# Altium project BMU_v50.PrjPcb (part 5 of 5)
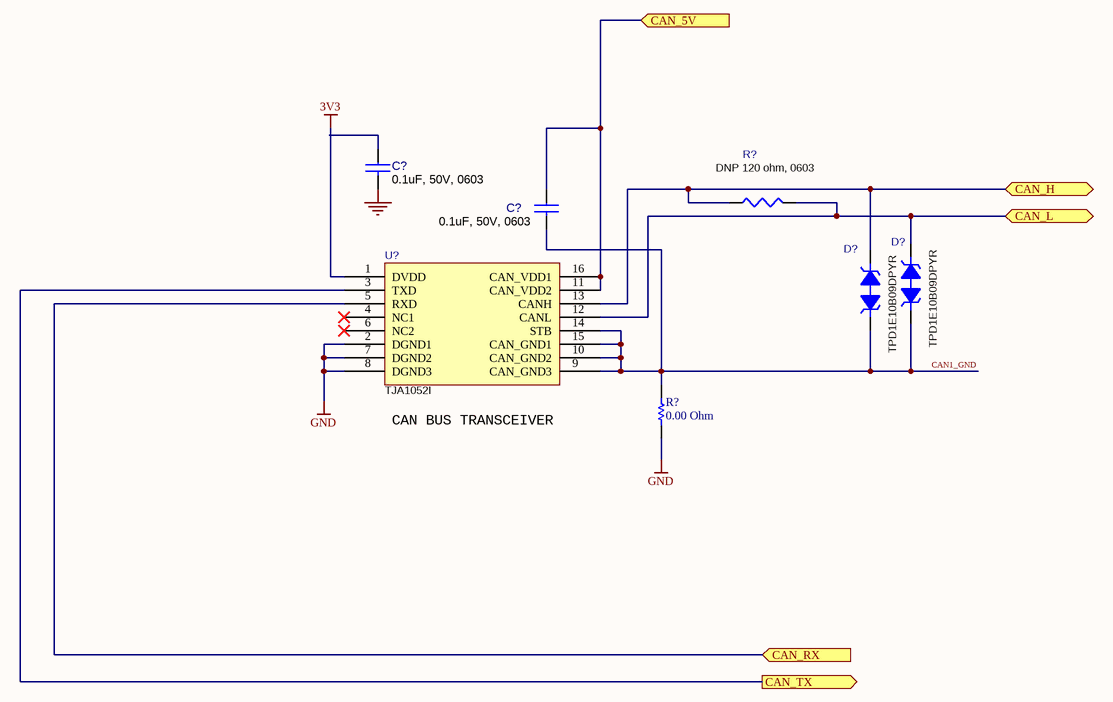
[diagram p12: BMU_V50_CAN.SchDoc]

## Nets that join several sheets
3V3: StringA/U_BMU_V50_StringFG (R?_StringA_U_BMU_V50_StringFG#2.2 R?_StringA_U_BMU_V50_StringFG#3.2 R?_StringA_U_BMU_V50_StringFG#4.2 R?_StringA_U_BMU_V50_StringFG#5.2), BMU_V50_MCUcomplex (21 pins), BMU_V50_MCUpower (L?#1.2 L?#4.2 TP?#3.1), BMU_V50_CAN (U?#3.1), StringB/U_BMU_V50_StringFG (R?_StringB_U_BMU_V50_StringFG#2.2 R?_StringB_U_BMU_V50_StringFG#3.2 R?_StringB_U_BMU_V50_StringFG#4.2 R?_StringB_U_BMU_V50_StringFG#5.2)
GND: BMU_V50_BlockDiagram (6 pins), BMU_V50_Connector (R?#1.1 R?#2.1 R?#3.2), StringA (6 pins), StringA/U_BMU_V50_StringFG (9 pins), StringA/U_BMU_V50_CellBalancer (D?_StringA_U_BMU_V50_CellBalancer.C J?_StringA_U_BMU_V50_CellBalancer#1.TAB1 J?_StringA_U_BMU_V50_CellBalancer#1.TAB2), StringA/U_BMU_V50_CellBalancer/U_BMU_V50_CellBalanceTaps (13 pins), StringA/U_BMU_V50_CellBalancer/U_BMU_V50_CellBalanceIC (15 pins), StringA/U_BMU_V50_CellBalancer/EXT_MEAS1 (C?_StringA_U_BMU_V50_CellBalancer_EXT_MEAS1.2), StringA/U_BMU_V50_CellBalancer/EXT_MEAS2 (C?_StringA_U_BMU_V50_CellBalancer_EXT_MEAS2.2), StringA/U_BMU_V50_CellBalancer/EXT_MEAS3 (C?_StringA_U_BMU_V50_CellBalancer_EXT_MEAS3.2), StringA/U_BMU_V50_CellBalancer/EXT_MEAS4 (C?_StringA_U_BMU_V50_CellBalancer_EXT_MEAS4.2), StringA/U_BMU_V50_StringPWRControl (C?_StringA_U_BMU_V50_StringPWRControl#5.1 C?_StringA_U_BMU_V50_StringPWRControl#7.1 R?_StringA_U_BMU_V50_StringPWRControl#13.1 U?_StringA_U_BMU_V50_StringPWRControl.9), BMU_V50_MCUcomplex (26 pins), BMU_V50_MCUpower (14 pins), BMU_V50_CAN (5 pins), StringB (6 pins), StringB/U_BMU_V50_StringFG (9 pins), StringB/U_BMU_V50_CellBalancer (D?_StringB_U_BMU_V50_CellBalancer.C J?_StringB_U_BMU_V50_CellBalancer#1.TAB1 J?_StringB_U_BMU_V50_CellBalancer#1.TAB2), StringB/U_BMU_V50_CellBalancer/U_BMU_V50_CellBalanceTaps (13 pins), StringB/U_BMU_V50_CellBalancer/U_BMU_V50_CellBalanceIC (15 pins), StringB/U_BMU_V50_CellBalancer/EXT_MEAS1 (C?_StringB_U_BMU_V50_CellBalancer_EXT_MEAS1.2), StringB/U_BMU_V50_CellBalancer/EXT_MEAS2 (C?_StringB_U_BMU_V50_CellBalancer_EXT_MEAS2.2), StringB/U_BMU_V50_CellBalancer/EXT_MEAS3 (C?_StringB_U_BMU_V50_CellBalancer_EXT_MEAS3.2), StringB/U_BMU_V50_CellBalancer/EXT_MEAS4 (C?_StringB_U_BMU_V50_CellBalancer_EXT_MEAS4.2), StringB/U_BMU_V50_StringPWRControl (C?_StringB_U_BMU_V50_StringPWRControl#5.1 C?_StringB_U_BMU_V50_StringPWRControl#7.1 R?_StringB_U_BMU_V50_StringPWRControl#13.1 U?_StringB_U_BMU_V50_StringPWRControl.9)
NEG: StringA/U_BMU_V50_StringPWRControl (C?_StringA_U_BMU_V50_StringPWRControl#6.2 D?_StringA_U_BMU_V50_StringPWRControl.1 R?_StringA_U_BMU_V50_StringPWRControl#11.1), StringB/U_BMU_V50_StringPWRControl (C?_StringB_U_BMU_V50_StringPWRControl#6.2 D?_StringB_U_BMU_V50_StringPWRControl.1 R?_StringB_U_BMU_V50_StringPWRControl#11.1)
CAN1_RX: BMU_V50_MCUcomplex (R?#8.1 U?#1.44), BMU_V50_CAN (U?#3.5)
CAN1_TX: BMU_V50_MCUcomplex (U?#1.45), BMU_V50_CAN (U?#3.3)
CAN_H: BMU_V50_Connector (J?#3.21), BMU_V50_CAN (D?#10.2 R?#21.1 U?#3.13)
CAN_L: BMU_V50_Connector (J?#3.22), BMU_V50_CAN (D?#9.2 R?#21.2 U?#3.12)
CHECK_INSERT_B: BMU_V50_Connector (J?#3.19), BMU_V50_MCUcomplex (U?#1.11)
I2C1_SCL: BMU_V50_BlockDiagram (J?#1.2), StringA/U_BMU_V50_StringFG (R?_StringA_U_BMU_V50_StringFG#5.1 U?_StringA_U_BMU_V50_StringFG.13), BMU_V50_MCUcomplex (R?#15.1 U?#1.58)
I2C1_SDA: BMU_V50_BlockDiagram (J?#1.3), StringA/U_BMU_V50_StringFG (R?_StringA_U_BMU_V50_StringFG#4.1 U?_StringA_U_BMU_V50_StringFG.14), BMU_V50_MCUcomplex (R?#16.1 U?#1.59)
I2C2_SCL: BMU_V50_BlockDiagram (J?#2.2), BMU_V50_MCUcomplex (R?#9.1 U?#1.42), StringB/U_BMU_V50_StringFG (R?_StringB_U_BMU_V50_StringFG#5.1 U?_StringB_U_BMU_V50_StringFG.13)
I2C2_SDA: BMU_V50_BlockDiagram (J?#2.3), BMU_V50_MCUcomplex (R?#10.1 U?#1.43), StringB/U_BMU_V50_StringFG (R?_StringB_U_BMU_V50_StringFG#4.1 U?_StringB_U_BMU_V50_StringFG.14)
NetC?#18_1: BMU_V50_Connector (J?#3.17), BMU_V50_CAN (C?#18.1 U?#3.11 U?#3.16)
NetC?_StringA_U_BMU_V50_CellBalancer_EXT_MEAS1_1: StringA (J?_StringA#2.1), StringA/U_BMU_V50_CellBalancer/EXT_MEAS1 (C?_StringA_U_BMU_V50_CellBalancer_EXT_MEAS1.1 R?_StringA_U_BMU_V50_CellBalancer_EXT_MEAS1#1.1 R?_StringA_U_BMU_V50_CellBalancer_EXT_MEAS1#2.1)
NetC?_StringA_U_BMU_V50_CellBalancer_EXT_MEAS2_1: StringA (J?_StringA#2.3), StringA/U_BMU_V50_CellBalancer/EXT_MEAS2 (C?_StringA_U_BMU_V50_CellBalancer_EXT_MEAS2.1 R?_StringA_U_BMU_V50_CellBalancer_EXT_MEAS2#1.1 R?_StringA_U_BMU_V50_CellBalancer_EXT_MEAS2#2.1)
NetC?_StringA_U_BMU_V50_CellBalancer_EXT_MEAS3_1: StringA (J?_StringA#2.5), StringA/U_BMU_V50_CellBalancer/EXT_MEAS3 (C?_StringA_U_BMU_V50_CellBalancer_EXT_MEAS3.1 R?_StringA_U_BMU_V50_CellBalancer_EXT_MEAS3#1.1 R?_StringA_U_BMU_V50_CellBalancer_EXT_MEAS3#2.1)
NetC?_StringA_U_BMU_V50_CellBalancer_EXT_MEAS4_1: StringA (J?_StringA#2.7), StringA/U_BMU_V50_CellBalancer/EXT_MEAS4 (C?_StringA_U_BMU_V50_CellBalancer_EXT_MEAS4.1 R?_StringA_U_BMU_V50_CellBalancer_EXT_MEAS4#1.1 R?_StringA_U_BMU_V50_CellBalancer_EXT_MEAS4#2.1)
NetC?_StringA_U_BMU_V50_CellBalancer_U_BMU_V50_CellBalanceTaps#1_1: StringA/U_BMU_V50_CellBalancer/U_BMU_V50_CellBalanceTaps (C?_StringA_U_BMU_V50_CellBalancer_U_BMU_V50_CellBalanceTaps#1.1 R?_StringA_U_BMU_V50_CellBalancer_U_BMU_V50_CellBalanceTaps#4.2), StringA/U_BMU_V50_CellBalancer/U_BMU_V50_CellBalanceIC (U?_StringA_U_BMU_V50_CellBalancer_U_BMU_V50_CellBalanceIC.60)
NetC?_StringA_U_BMU_V50_CellBalancer_U_BMU_V50_CellBalanceTaps#2_1: StringA/U_BMU_V50_CellBalancer/U_BMU_V50_CellBalanceTaps (C?_StringA_U_BMU_V50_CellBalancer_U_BMU_V50_CellBalanceTaps#2.1 R?_StringA_U_BMU_V50_CellBalancer_U_BMU_V50_CellBalanceTaps#1.2), StringA/U_BMU_V50_CellBalancer/U_BMU_V50_CellBalanceIC (U?_StringA_U_BMU_V50_CellBalancer_U_BMU_V50_CellBalanceIC.10)
NetC?_StringA_U_BMU_V50_CellBalancer_U_BMU_V50_CellBalanceTaps#3_1: StringA/U_BMU_V50_CellBalancer (J?_StringA_U_BMU_V50_CellBalancer#1.13), StringA/U_BMU_V50_CellBalancer/U_BMU_V50_CellBalanceTaps (5 pins)
NetC?_StringA_U_BMU_V50_CellBalancer_U_BMU_V50_CellBalanceTaps#4_1: StringA/U_BMU_V50_CellBalancer (J?_StringA_U_BMU_V50_CellBalancer#1.11), StringA/U_BMU_V50_CellBalancer/U_BMU_V50_CellBalanceTaps (8 pins)
NetC?_StringA_U_BMU_V50_CellBalancer_U_BMU_V50_CellBalanceTaps#5_2: StringA/U_BMU_V50_CellBalancer (J?_StringA_U_BMU_V50_CellBalancer#1.10), StringA/U_BMU_V50_CellBalancer/U_BMU_V50_CellBalanceTaps (7 pins)
NetC?_StringA_U_BMU_V50_CellBalancer_U_BMU_V50_CellBalanceTaps#6_2: StringA/U_BMU_V50_CellBalancer (J?_StringA_U_BMU_V50_CellBalancer#1.12), StringA/U_BMU_V50_CellBalancer/U_BMU_V50_CellBalanceTaps (8 pins)
NetC?_StringA_U_BMU_V50_CellBalancer_U_BMU_V50_CellBalanceTaps#7_1: StringA/U_BMU_V50_CellBalancer/U_BMU_V50_CellBalanceTaps (C?_StringA_U_BMU_V50_CellBalancer_U_BMU_V50_CellBalanceTaps#7.1 R?_StringA_U_BMU_V50_CellBalancer_U_BMU_V50_CellBalanceTaps#2.2), StringA/U_BMU_V50_CellBalancer/U_BMU_V50_CellBalanceIC (U?_StringA_U_BMU_V50_CellBalancer_U_BMU_V50_CellBalanceIC.64)
NetC?_StringA_U_BMU_V50_CellBalancer_U_BMU_V50_CellBalanceTaps#8_1: StringA/U_BMU_V50_CellBalancer (J?_StringA_U_BMU_V50_CellBalancer#1.6), StringA/U_BMU_V50_CellBalancer/U_BMU_V50_CellBalanceTaps (8 pins)
NetC?_StringA_U_BMU_V50_CellBalancer_U_BMU_V50_CellBalanceTaps#8_2: StringA/U_BMU_V50_CellBalancer (J?_StringA_U_BMU_V50_CellBalancer#1.5), StringA/U_BMU_V50_CellBalancer/U_BMU_V50_CellBalanceTaps (8 pins)
NetC?_StringA_U_BMU_V50_CellBalancer_U_BMU_V50_CellBalanceTaps#10_1: StringA/U_BMU_V50_CellBalancer/U_BMU_V50_CellBalanceTaps (C?_StringA_U_BMU_V50_CellBalancer_U_BMU_V50_CellBalanceTaps#10.1 R?_StringA_U_BMU_V50_CellBalancer_U_BMU_V50_CellBalanceTaps#15.2), StringA/U_BMU_V50_CellBalancer/U_BMU_V50_CellBalanceIC (U?_StringA_U_BMU_V50_CellBalancer_U_BMU_V50_CellBalanceIC.2)
NetC?_StringA_U_BMU_V50_CellBalancer_U_BMU_V50_CellBalanceTaps#11_1: StringA/U_BMU_V50_CellBalancer/U_BMU_V50_CellBalanceTaps (C?_StringA_U_BMU_V50_CellBalancer_U_BMU_V50_CellBalanceTaps#11.1 R?_StringA_U_BMU_V50_CellBalancer_U_BMU_V50_CellBalanceTaps#16.2), StringA/U_BMU_V50_CellBalancer/U_BMU_V50_CellBalanceIC (U?_StringA_U_BMU_V50_CellBalancer_U_BMU_V50_CellBalanceIC.12)
NetC?_StringA_U_BMU_V50_CellBalancer_U_BMU_V50_CellBalanceTaps#12_1: StringA/U_BMU_V50_CellBalancer/U_BMU_V50_CellBalanceTaps (C?_StringA_U_BMU_V50_CellBalancer_U_BMU_V50_CellBalanceTaps#12.1 R?_StringA_U_BMU_V50_CellBalancer_U_BMU_V50_CellBalanceTaps#20.2), StringA/U_BMU_V50_CellBalancer/U_BMU_V50_CellBalanceIC (U?_StringA_U_BMU_V50_CellBalancer_U_BMU_V50_CellBalanceIC.62)
NetC?_StringA_U_BMU_V50_CellBalancer_U_BMU_V50_CellBalanceTaps#15_2: StringA/U_BMU_V50_CellBalancer (J?_StringA_U_BMU_V50_CellBalancer#1.4), StringA/U_BMU_V50_CellBalancer/U_BMU_V50_CellBalanceTaps (8 pins)
NetC?_StringA_U_BMU_V50_CellBalancer_U_BMU_V50_CellBalanceTaps#17_1: StringA/U_BMU_V50_CellBalancer/U_BMU_V50_CellBalanceTaps (C?_StringA_U_BMU_V50_CellBalancer_U_BMU_V50_CellBalanceTaps#17.1 R?_StringA_U_BMU_V50_CellBalancer_U_BMU_V50_CellBalanceTaps#28.2), StringA/U_BMU_V50_CellBalancer/U_BMU_V50_CellBalanceIC (U?_StringA_U_BMU_V50_CellBalancer_U_BMU_V50_CellBalanceIC.14)
NetC?_StringA_U_BMU_V50_CellBalancer_U_BMU_V50_CellBalanceTaps#18_2: StringA/U_BMU_V50_CellBalancer (J?_StringA_U_BMU_V50_CellBalancer#1.9), StringA/U_BMU_V50_CellBalancer/U_BMU_V50_CellBalanceTaps (8 pins)
NetC?_StringA_U_BMU_V50_CellBalancer_U_BMU_V50_CellBalanceTaps#20_2: StringA/U_BMU_V50_CellBalancer (J?_StringA_U_BMU_V50_CellBalancer#1.3), StringA/U_BMU_V50_CellBalancer/U_BMU_V50_CellBalanceTaps (8 pins)
NetC?_StringA_U_BMU_V50_CellBalancer_U_BMU_V50_CellBalanceTaps#22_1: StringA/U_BMU_V50_CellBalancer/U_BMU_V50_CellBalanceTaps (C?_StringA_U_BMU_V50_CellBalancer_U_BMU_V50_CellBalanceTaps#22.1 R?_StringA_U_BMU_V50_CellBalancer_U_BMU_V50_CellBalanceTaps#38.2), StringA/U_BMU_V50_CellBalancer/U_BMU_V50_CellBalanceIC (U?_StringA_U_BMU_V50_CellBalancer_U_BMU_V50_CellBalanceIC.4)
NetC?_StringA_U_BMU_V50_CellBalancer_U_BMU_V50_CellBalanceTaps#23_1: StringA/U_BMU_V50_CellBalancer/U_BMU_V50_CellBalanceTaps (C?_StringA_U_BMU_V50_CellBalancer_U_BMU_V50_CellBalanceTaps#23.1 R?_StringA_U_BMU_V50_CellBalancer_U_BMU_V50_CellBalanceTaps#39.2), StringA/U_BMU_V50_CellBalancer/U_BMU_V50_CellBalanceIC (U?_StringA_U_BMU_V50_CellBalancer_U_BMU_V50_CellBalanceIC.16)
NetC?_StringA_U_BMU_V50_CellBalancer_U_BMU_V50_CellBalanceTaps#24_2: StringA/U_BMU_V50_CellBalancer (J?_StringA_U_BMU_V50_CellBalancer#1.8), StringA/U_BMU_V50_CellBalancer/U_BMU_V50_CellBalanceTaps (8 pins)
NetC?_StringA_U_BMU_V50_CellBalancer_U_BMU_V50_CellBalanceTaps#26_2: StringA/U_BMU_V50_CellBalancer (J?_StringA_U_BMU_V50_CellBalancer#1.2), StringA/U_BMU_V50_CellBalancer/U_BMU_V50_CellBalanceTaps (8 pins)
NetC?_StringA_U_BMU_V50_CellBalancer_U_BMU_V50_CellBalanceTaps#28_1: StringA/U_BMU_V50_CellBalancer/U_BMU_V50_CellBalanceTaps (C?_StringA_U_BMU_V50_CellBalancer_U_BMU_V50_CellBalanceTaps#28.1 R?_StringA_U_BMU_V50_CellBalancer_U_BMU_V50_CellBalanceTaps#46.2), StringA/U_BMU_V50_CellBalancer/U_BMU_V50_CellBalanceIC (U?_StringA_U_BMU_V50_CellBalancer_U_BMU_V50_CellBalanceIC.18)
NetC?_StringA_U_BMU_V50_CellBalancer_U_BMU_V50_CellBalanceTaps#29_1: StringA/U_BMU_V50_CellBalancer/U_BMU_V50_CellBalanceTaps (C?_StringA_U_BMU_V50_CellBalancer_U_BMU_V50_CellBalanceTaps#29.1 R?_StringA_U_BMU_V50_CellBalancer_U_BMU_V50_CellBalanceTaps#50.2), StringA/U_BMU_V50_CellBalancer/U_BMU_V50_CellBalanceIC (U?_StringA_U_BMU_V50_CellBalancer_U_BMU_V50_CellBalanceIC.6)
NetC?_StringA_U_BMU_V50_CellBalancer_U_BMU_V50_CellBalanceTaps#30_2: StringA/U_BMU_V50_CellBalancer (J?_StringA_U_BMU_V50_CellBalancer#1.1), StringA/U_BMU_V50_CellBalancer/U_BMU_V50_CellBalanceTaps (5 pins)
NetC?_StringA_U_BMU_V50_CellBalancer_U_BMU_V50_CellBalanceTaps#31_2: StringA/U_BMU_V50_CellBalancer (J?_StringA_U_BMU_V50_CellBalancer#1.7), StringA/U_BMU_V50_CellBalancer/U_BMU_V50_CellBalanceTaps (8 pins)
NetC?_StringA_U_BMU_V50_CellBalancer_U_BMU_V50_CellBalanceTaps#33_1: StringA/U_BMU_V50_CellBalancer/U_BMU_V50_CellBalanceTaps (C?_StringA_U_BMU_V50_CellBalancer_U_BMU_V50_CellBalanceTaps#33.1 R?_StringA_U_BMU_V50_CellBalancer_U_BMU_V50_CellBalanceTaps#56.2), StringA/U_BMU_V50_CellBalancer/U_BMU_V50_CellBalanceIC (U?_StringA_U_BMU_V50_CellBalancer_U_BMU_V50_CellBalanceIC.20)
NetC?_StringA_U_BMU_V50_CellBalancer_U_BMU_V50_CellBalanceTaps#35_1: StringA/U_BMU_V50_CellBalancer/U_BMU_V50_CellBalanceTaps (C?_StringA_U_BMU_V50_CellBalancer_U_BMU_V50_CellBalanceTaps#35.1 R?_StringA_U_BMU_V50_CellBalancer_U_BMU_V50_CellBalanceTaps#58.2), StringA/U_BMU_V50_CellBalancer/U_BMU_V50_CellBalanceIC (U?_StringA_U_BMU_V50_CellBalancer_U_BMU_V50_CellBalanceIC.8)
NetC?_StringA_U_BMU_V50_StringFG#2_1: StringA (J?_StringA#2.9), StringA/U_BMU_V50_StringFG (C?_StringA_U_BMU_V50_StringFG#2.1 U?_StringA_U_BMU_V50_StringFG.7)
NetC?_StringA_U_BMU_V50_StringPWRControl#1_1: StringA (J?_StringA#1.1), StringA/U_BMU_V50_StringFG (Q?_StringA_U_BMU_V50_StringFG#1.2 R?_StringA_U_BMU_V50_StringFG#1.2), StringA/U_BMU_V50_CellBalancer/U_BMU_V50_CellBalanceIC (R?_StringA_U_BMU_V50_CellBalancer_U_BMU_V50_CellBalanceIC#1.2 R?_StringA_U_BMU_V50_CellBalancer_U_BMU_V50_CellBalanceIC#2.1), StringA/U_BMU_V50_StringPWRControl (13 pins)
NetC?_StringA_U_BMU_V50_StringPWRControl#2_2: BMU_V50_Connector (6 pins), StringA/U_BMU_V50_StringPWRControl (15 pins), BMU_V50_MCUpower (R?#17.2), StringB/U_BMU_V50_StringPWRControl (15 pins)
NetC?_StringB_U_BMU_V50_CellBalancer_EXT_MEAS1_1: StringB (J?_StringB#2.1), StringB/U_BMU_V50_CellBalancer/EXT_MEAS1 (C?_StringB_U_BMU_V50_CellBalancer_EXT_MEAS1.1 R?_StringB_U_BMU_V50_CellBalancer_EXT_MEAS1#1.1 R?_StringB_U_BMU_V50_CellBalancer_EXT_MEAS1#2.1)
NetC?_StringB_U_BMU_V50_CellBalancer_EXT_MEAS2_1: StringB (J?_StringB#2.3), StringB/U_BMU_V50_CellBalancer/EXT_MEAS2 (C?_StringB_U_BMU_V50_CellBalancer_EXT_MEAS2.1 R?_StringB_U_BMU_V50_CellBalancer_EXT_MEAS2#1.1 R?_StringB_U_BMU_V50_CellBalancer_EXT_MEAS2#2.1)
NetC?_StringB_U_BMU_V50_CellBalancer_EXT_MEAS3_1: StringB (J?_StringB#2.5), StringB/U_BMU_V50_CellBalancer/EXT_MEAS3 (C?_StringB_U_BMU_V50_CellBalancer_EXT_MEAS3.1 R?_StringB_U_BMU_V50_CellBalancer_EXT_MEAS3#1.1 R?_StringB_U_BMU_V50_CellBalancer_EXT_MEAS3#2.1)
NetC?_StringB_U_BMU_V50_CellBalancer_EXT_MEAS4_1: StringB (J?_StringB#2.7), StringB/U_BMU_V50_CellBalancer/EXT_MEAS4 (C?_StringB_U_BMU_V50_CellBalancer_EXT_MEAS4.1 R?_StringB_U_BMU_V50_CellBalancer_EXT_MEAS4#1.1 R?_StringB_U_BMU_V50_CellBalancer_EXT_MEAS4#2.1)
NetC?_StringB_U_BMU_V50_CellBalancer_U_BMU_V50_CellBalanceTaps#1_1: StringB/U_BMU_V50_CellBalancer/U_BMU_V50_CellBalanceTaps (C?_StringB_U_BMU_V50_CellBalancer_U_BMU_V50_CellBalanceTaps#1.1 R?_StringB_U_BMU_V50_CellBalancer_U_BMU_V50_CellBalanceTaps#4.2), StringB/U_BMU_V50_CellBalancer/U_BMU_V50_CellBalanceIC (U?_StringB_U_BMU_V50_CellBalancer_U_BMU_V50_CellBalanceIC.60)
NetC?_StringB_U_BMU_V50_CellBalancer_U_BMU_V50_CellBalanceTaps#2_1: StringB/U_BMU_V50_CellBalancer/U_BMU_V50_CellBalanceTaps (C?_StringB_U_BMU_V50_CellBalancer_U_BMU_V50_CellBalanceTaps#2.1 R?_StringB_U_BMU_V50_CellBalancer_U_BMU_V50_CellBalanceTaps#1.2), StringB/U_BMU_V50_CellBalancer/U_BMU_V50_CellBalanceIC (U?_StringB_U_BMU_V50_CellBalancer_U_BMU_V50_CellBalanceIC.10)
NetC?_StringB_U_BMU_V50_CellBalancer_U_BMU_V50_CellBalanceTaps#3_1: StringB/U_BMU_V50_CellBalancer (J?_StringB_U_BMU_V50_CellBalancer#1.13), StringB/U_BMU_V50_CellBalancer/U_BMU_V50_CellBalanceTaps (5 pins)
NetC?_StringB_U_BMU_V50_CellBalancer_U_BMU_V50_CellBalanceTaps#4_1: StringB/U_BMU_V50_CellBalancer (J?_StringB_U_BMU_V50_CellBalancer#1.11), StringB/U_BMU_V50_CellBalancer/U_BMU_V50_CellBalanceTaps (8 pins)
NetC?_StringB_U_BMU_V50_CellBalancer_U_BMU_V50_CellBalanceTaps#5_2: StringB/U_BMU_V50_CellBalancer (J?_StringB_U_BMU_V50_CellBalancer#1.10), StringB/U_BMU_V50_CellBalancer/U_BMU_V50_CellBalanceTaps (7 pins)
NetC?_StringB_U_BMU_V50_CellBalancer_U_BMU_V50_CellBalanceTaps#6_2: StringB/U_BMU_V50_CellBalancer (J?_StringB_U_BMU_V50_CellBalancer#1.12), StringB/U_BMU_V50_CellBalancer/U_BMU_V50_CellBalanceTaps (8 pins)
NetC?_StringB_U_BMU_V50_CellBalancer_U_BMU_V50_CellBalanceTaps#7_1: StringB/U_BMU_V50_CellBalancer/U_BMU_V50_CellBalanceTaps (C?_StringB_U_BMU_V50_CellBalancer_U_BMU_V50_CellBalanceTaps#7.1 R?_StringB_U_BMU_V50_CellBalancer_U_BMU_V50_CellBalanceTaps#2.2), StringB/U_BMU_V50_CellBalancer/U_BMU_V50_CellBalanceIC (U?_StringB_U_BMU_V50_CellBalancer_U_BMU_V50_CellBalanceIC.64)
NetC?_StringB_U_BMU_V50_CellBalancer_U_BMU_V50_CellBalanceTaps#8_1: StringB/U_BMU_V50_CellBalancer (J?_StringB_U_BMU_V50_CellBalancer#1.6), StringB/U_BMU_V50_CellBalancer/U_BMU_V50_CellBalanceTaps (8 pins)
NetC?_StringB_U_BMU_V50_CellBalancer_U_BMU_V50_CellBalanceTaps#8_2: StringB/U_BMU_V50_CellBalancer (J?_StringB_U_BMU_V50_CellBalancer#1.5), StringB/U_BMU_V50_CellBalancer/U_BMU_V50_CellBalanceTaps (8 pins)
NetC?_StringB_U_BMU_V50_CellBalancer_U_BMU_V50_CellBalanceTaps#10_1: StringB/U_BMU_V50_CellBalancer/U_BMU_V50_CellBalanceTaps (C?_StringB_U_BMU_V50_CellBalancer_U_BMU_V50_CellBalanceTaps#10.1 R?_StringB_U_BMU_V50_CellBalancer_U_BMU_V50_CellBalanceTaps#15.2), StringB/U_BMU_V50_CellBalancer/U_BMU_V50_CellBalanceIC (U?_StringB_U_BMU_V50_CellBalancer_U_BMU_V50_CellBalanceIC.2)
NetC?_StringB_U_BMU_V50_CellBalancer_U_BMU_V50_CellBalanceTaps#11_1: StringB/U_BMU_V50_CellBalancer/U_BMU_V50_CellBalanceTaps (C?_StringB_U_BMU_V50_CellBalancer_U_BMU_V50_CellBalanceTaps#11.1 R?_StringB_U_BMU_V50_CellBalancer_U_BMU_V50_CellBalanceTaps#16.2), StringB/U_BMU_V50_CellBalancer/U_BMU_V50_CellBalanceIC (U?_StringB_U_BMU_V50_CellBalancer_U_BMU_V50_CellBalanceIC.12)
NetC?_StringB_U_BMU_V50_CellBalancer_U_BMU_V50_CellBalanceTaps#12_1: StringB/U_BMU_V50_CellBalancer/U_BMU_V50_CellBalanceTaps (C?_StringB_U_BMU_V50_CellBalancer_U_BMU_V50_CellBalanceTaps#12.1 R?_StringB_U_BMU_V50_CellBalancer_U_BMU_V50_CellBalanceTaps#20.2), StringB/U_BMU_V50_CellBalancer/U_BMU_V50_CellBalanceIC (U?_StringB_U_BMU_V50_CellBalancer_U_BMU_V50_CellBalanceIC.62)
NetC?_StringB_U_BMU_V50_CellBalancer_U_BMU_V50_CellBalanceTaps#15_2: StringB/U_BMU_V50_CellBalancer (J?_StringB_U_BMU_V50_CellBalancer#1.4), StringB/U_BMU_V50_CellBalancer/U_BMU_V50_CellBalanceTaps (8 pins)
NetC?_StringB_U_BMU_V50_CellBalancer_U_BMU_V50_CellBalanceTaps#17_1: StringB/U_BMU_V50_CellBalancer/U_BMU_V50_CellBalanceTaps (C?_StringB_U_BMU_V50_CellBalancer_U_BMU_V50_CellBalanceTaps#17.1 R?_StringB_U_BMU_V50_CellBalancer_U_BMU_V50_CellBalanceTaps#28.2), StringB/U_BMU_V50_CellBalancer/U_BMU_V50_CellBalanceIC (U?_StringB_U_BMU_V50_CellBalancer_U_BMU_V50_CellBalanceIC.14)
NetC?_StringB_U_BMU_V50_CellBalancer_U_BMU_V50_CellBalanceTaps#18_2: StringB/U_BMU_V50_CellBalancer (J?_StringB_U_BMU_V50_CellBalancer#1.9), StringB/U_BMU_V50_CellBalancer/U_BMU_V50_CellBalanceTaps (8 pins)
NetC?_StringB_U_BMU_V50_CellBalancer_U_BMU_V50_CellBalanceTaps#20_2: StringB/U_BMU_V50_CellBalancer (J?_StringB_U_BMU_V50_CellBalancer#1.3), StringB/U_BMU_V50_CellBalancer/U_BMU_V50_CellBalanceTaps (8 pins)
NetC?_StringB_U_BMU_V50_CellBalancer_U_BMU_V50_CellBalanceTaps#22_1: StringB/U_BMU_V50_CellBalancer/U_BMU_V50_CellBalanceTaps (C?_StringB_U_BMU_V50_CellBalancer_U_BMU_V50_CellBalanceTaps#22.1 R?_StringB_U_BMU_V50_CellBalancer_U_BMU_V50_CellBalanceTaps#38.2), StringB/U_BMU_V50_CellBalancer/U_BMU_V50_CellBalanceIC (U?_StringB_U_BMU_V50_CellBalancer_U_BMU_V50_CellBalanceIC.4)
NetC?_StringB_U_BMU_V50_CellBalancer_U_BMU_V50_CellBalanceTaps#23_1: StringB/U_BMU_V50_CellBalancer/U_BMU_V50_CellBalanceTaps (C?_StringB_U_BMU_V50_CellBalancer_U_BMU_V50_CellBalanceTaps#23.1 R?_StringB_U_BMU_V50_CellBalancer_U_BMU_V50_CellBalanceTaps#39.2), StringB/U_BMU_V50_CellBalancer/U_BMU_V50_CellBalanceIC (U?_StringB_U_BMU_V50_CellBalancer_U_BMU_V50_CellBalanceIC.16)
NetC?_StringB_U_BMU_V50_CellBalancer_U_BMU_V50_CellBalanceTaps#24_2: StringB/U_BMU_V50_CellBalancer (J?_StringB_U_BMU_V50_CellBalancer#1.8), StringB/U_BMU_V50_CellBalancer/U_BMU_V50_CellBalanceTaps (8 pins)
NetC?_StringB_U_BMU_V50_CellBalancer_U_BMU_V50_CellBalanceTaps#26_2: StringB/U_BMU_V50_CellBalancer (J?_StringB_U_BMU_V50_CellBalancer#1.2), StringB/U_BMU_V50_CellBalancer/U_BMU_V50_CellBalanceTaps (8 pins)
NetC?_StringB_U_BMU_V50_CellBalancer_U_BMU_V50_CellBalanceTaps#28_1: StringB/U_BMU_V50_CellBalancer/U_BMU_V50_CellBalanceTaps (C?_StringB_U_BMU_V50_CellBalancer_U_BMU_V50_CellBalanceTaps#28.1 R?_StringB_U_BMU_V50_CellBalancer_U_BMU_V50_CellBalanceTaps#46.2), StringB/U_BMU_V50_CellBalancer/U_BMU_V50_CellBalanceIC (U?_StringB_U_BMU_V50_CellBalancer_U_BMU_V50_CellBalanceIC.18)
NetC?_StringB_U_BMU_V50_CellBalancer_U_BMU_V50_CellBalanceTaps#29_1: StringB/U_BMU_V50_CellBalancer/U_BMU_V50_CellBalanceTaps (C?_StringB_U_BMU_V50_CellBalancer_U_BMU_V50_CellBalanceTaps#29.1 R?_StringB_U_BMU_V50_CellBalancer_U_BMU_V50_CellBalanceTaps#50.2), StringB/U_BMU_V50_CellBalancer/U_BMU_V50_CellBalanceIC (U?_StringB_U_BMU_V50_CellBalancer_U_BMU_V50_CellBalanceIC.6)
NetC?_StringB_U_BMU_V50_CellBalancer_U_BMU_V50_CellBalanceTaps#30_2: StringB/U_BMU_V50_CellBalancer (J?_StringB_U_BMU_V50_CellBalancer#1.1), StringB/U_BMU_V50_CellBalancer/U_BMU_V50_CellBalanceTaps (5 pins)
NetC?_StringB_U_BMU_V50_CellBalancer_U_BMU_V50_CellBalanceTaps#31_2: StringB/U_BMU_V50_CellBalancer (J?_StringB_U_BMU_V50_CellBalancer#1.7), StringB/U_BMU_V50_CellBalancer/U_BMU_V50_CellBalanceTaps (8 pins)
NetC?_StringB_U_BMU_V50_CellBalancer_U_BMU_V50_CellBalanceTaps#33_1: StringB/U_BMU_V50_CellBalancer/U_BMU_V50_CellBalanceTaps (C?_StringB_U_BMU_V50_CellBalancer_U_BMU_V50_CellBalanceTaps#33.1 R?_StringB_U_BMU_V50_CellBalancer_U_BMU_V50_CellBalanceTaps#56.2), StringB/U_BMU_V50_CellBalancer/U_BMU_V50_CellBalanceIC (U?_StringB_U_BMU_V50_CellBalancer_U_BMU_V50_CellBalanceIC.20)
NetC?_StringB_U_BMU_V50_CellBalancer_U_BMU_V50_CellBalanceTaps#35_1: StringB/U_BMU_V50_CellBalancer/U_BMU_V50_CellBalanceTaps (C?_StringB_U_BMU_V50_CellBalancer_U_BMU_V50_CellBalanceTaps#35.1 R?_StringB_U_BMU_V50_CellBalancer_U_BMU_V50_CellBalanceTaps#58.2), StringB/U_BMU_V50_CellBalancer/U_BMU_V50_CellBalanceIC (U?_StringB_U_BMU_V50_CellBalancer_U_BMU_V50_CellBalanceIC.8)
NetC?_StringB_U_BMU_V50_StringFG#2_1: StringB (J?_StringB#2.9), StringB/U_BMU_V50_StringFG (C?_StringB_U_BMU_V50_StringFG#2.1 U?_StringB_U_BMU_V50_StringFG.7)
NetC?_StringB_U_BMU_V50_StringPWRControl#1_1: StringB (J?_StringB#1.1), StringB/U_BMU_V50_StringFG (Q?_StringB_U_BMU_V50_StringFG#1.2 R?_StringB_U_BMU_V50_StringFG#1.2), StringB/U_BMU_V50_CellBalancer/U_BMU_V50_CellBalanceIC (R?_StringB_U_BMU_V50_CellBalancer_U_BMU_V50_CellBalanceIC#1.2 R?_StringB_U_BMU_V50_CellBalancer_U_BMU_V50_CellBalanceIC#2.1), StringB/U_BMU_V50_StringPWRControl (13 pins)
NetD?#4_2: StringA/U_BMU_V50_CellBalancer/U_BMU_V50_CellBalanceIC (U?_StringA_U_BMU_V50_CellBalancer_U_BMU_V50_CellBalanceIC.45), BMU_V50_MCUcomplex (D?#4.2 U?#1.38)
NetD?#5_2: BMU_V50_MCUcomplex (D?#5.2 U?#1.40), StringB/U_BMU_V50_CellBalancer/U_BMU_V50_CellBalanceIC (U?_StringB_U_BMU_V50_CellBalancer_U_BMU_V50_CellBalanceIC.45)
NetD?#6_2: BMU_V50_Connector (J?#3.3), BMU_V50_MCUpower (D?#6.2)
NetJ?#3_4: BMU_V50_Connector (J?#3.4), BMU_V50_MCUcomplex (U?#1.39)
NetJ?#3_P1: BMU_V50_Connector (J?#3.P1 J?#3.P5 J?#3.P6), StringA (R?_StringA#1.2 R?_StringA#2.1 R?_StringA#3.1), StringB (R?_StringB#1.2 R?_StringB#2.1 R?_StringB#3.1)
NetJ?_StringA#2_10: StringA (J?_StringA#2.10), StringA/U_BMU_V50_StringFG (U?_StringA_U_BMU_V50_StringFG.11)
NetJ?_StringB#2_10: StringB (J?_StringB#2.10), StringB/U_BMU_V50_StringFG (U?_StringB_U_BMU_V50_StringFG.11)
NetR?_StringA#1_3: StringA (R?_StringA#1.3 R?_StringA#2.4 R?_StringA#3.4), StringA/U_BMU_V50_StringFG (R?_StringA_U_BMU_V50_StringFG#10.1)
NetR?_StringA#1_4: StringA (R?_StringA#1.4 R?_StringA#2.3 R?_StringA#3.3), StringA/U_BMU_V50_StringFG (R?_StringA_U_BMU_V50_StringFG#11.1)
NetR?_StringA_U_BMU_V50_CellBalancer_EXT_MEAS1#1_2: StringA/U_BMU_V50_CellBalancer/U_BMU_V50_CellBalanceIC (U?_StringA_U_BMU_V50_CellBalancer_U_BMU_V50_CellBalanceIC.29), StringA/U_BMU_V50_CellBalancer/EXT_MEAS1 (R?_StringA_U_BMU_V50_CellBalancer_EXT_MEAS1#1.2), StringA/U_BMU_V50_CellBalancer/EXT_MEAS2 (R?_StringA_U_BMU_V50_CellBalancer_EXT_MEAS2#1.2), StringA/U_BMU_V50_CellBalancer/EXT_MEAS3 (R?_StringA_U_BMU_V50_CellBalancer_EXT_MEAS3#1.2), StringA/U_BMU_V50_CellBalancer/EXT_MEAS4 (R?_StringA_U_BMU_V50_CellBalancer_EXT_MEAS4#1.2)
NetR?_StringA_U_BMU_V50_CellBalancer_EXT_MEAS1#2_2: StringA/U_BMU_V50_CellBalancer/U_BMU_V50_CellBalanceIC (U?_StringA_U_BMU_V50_CellBalancer_U_BMU_V50_CellBalanceIC.24), StringA/U_BMU_V50_CellBalancer/EXT_MEAS1 (R?_StringA_U_BMU_V50_CellBalancer_EXT_MEAS1#2.2)
NetR?_StringA_U_BMU_V50_CellBalancer_EXT_MEAS2#2_2: StringA/U_BMU_V50_CellBalancer/U_BMU_V50_CellBalanceIC (U?_StringA_U_BMU_V50_CellBalancer_U_BMU_V50_CellBalanceIC.26), StringA/U_BMU_V50_CellBalancer/EXT_MEAS2 (R?_StringA_U_BMU_V50_CellBalancer_EXT_MEAS2#2.2)
NetR?_StringA_U_BMU_V50_CellBalancer_EXT_MEAS3#2_2: StringA/U_BMU_V50_CellBalancer/U_BMU_V50_CellBalanceIC (U?_StringA_U_BMU_V50_CellBalancer_U_BMU_V50_CellBalanceIC.28), StringA/U_BMU_V50_CellBalancer/EXT_MEAS3 (R?_StringA_U_BMU_V50_CellBalancer_EXT_MEAS3#2.2)
NetR?_StringA_U_BMU_V50_CellBalancer_EXT_MEAS4#2_2: StringA/U_BMU_V50_CellBalancer/U_BMU_V50_CellBalanceIC (U?_StringA_U_BMU_V50_CellBalancer_U_BMU_V50_CellBalanceIC.30), StringA/U_BMU_V50_CellBalancer/EXT_MEAS4 (R?_StringA_U_BMU_V50_CellBalancer_EXT_MEAS4#2.2)
NetR?_StringA_U_BMU_V50_CellBalancer_U_BMU_V50_CellBalanceTaps#7_2: StringA/U_BMU_V50_CellBalancer/U_BMU_V50_CellBalanceTaps (R?_StringA_U_BMU_V50_CellBalancer_U_BMU_V50_CellBalanceTaps#7.2), StringA/U_BMU_V50_CellBalancer/U_BMU_V50_CellBalanceIC (U?_StringA_U_BMU_V50_CellBalancer_U_BMU_V50_CellBalanceIC.61)
NetR?_StringA_U_BMU_V50_CellBalancer_U_BMU_V50_CellBalanceTaps#8_2: StringA/U_BMU_V50_CellBalancer/U_BMU_V50_CellBalanceTaps (R?_StringA_U_BMU_V50_CellBalancer_U_BMU_V50_CellBalanceTaps#8.2), StringA/U_BMU_V50_CellBalancer/U_BMU_V50_CellBalanceIC (U?_StringA_U_BMU_V50_CellBalancer_U_BMU_V50_CellBalanceIC.1)
NetR?_StringA_U_BMU_V50_CellBalancer_U_BMU_V50_CellBalanceTaps#11_2: StringA/U_BMU_V50_CellBalancer/U_BMU_V50_CellBalanceTaps (R?_StringA_U_BMU_V50_CellBalancer_U_BMU_V50_CellBalanceTaps#11.2), StringA/U_BMU_V50_CellBalancer/U_BMU_V50_CellBalanceIC (U?_StringA_U_BMU_V50_CellBalancer_U_BMU_V50_CellBalanceIC.11)
NetR?_StringA_U_BMU_V50_CellBalancer_U_BMU_V50_CellBalanceTaps#22_2: StringA/U_BMU_V50_CellBalancer/U_BMU_V50_CellBalanceTaps (R?_StringA_U_BMU_V50_CellBalancer_U_BMU_V50_CellBalanceTaps#22.2), StringA/U_BMU_V50_CellBalancer/U_BMU_V50_CellBalanceIC (U?_StringA_U_BMU_V50_CellBalancer_U_BMU_V50_CellBalanceIC.63)
NetR?_StringA_U_BMU_V50_CellBalancer_U_BMU_V50_CellBalanceTaps#24_2: StringA/U_BMU_V50_CellBalancer/U_BMU_V50_CellBalanceTaps (R?_StringA_U_BMU_V50_CellBalancer_U_BMU_V50_CellBalanceTaps#24.2), StringA/U_BMU_V50_CellBalancer/U_BMU_V50_CellBalanceIC (U?_StringA_U_BMU_V50_CellBalancer_U_BMU_V50_CellBalanceIC.13)
NetR?_StringA_U_BMU_V50_CellBalancer_U_BMU_V50_CellBalanceTaps#29_2: StringA/U_BMU_V50_CellBalancer/U_BMU_V50_CellBalanceTaps (R?_StringA_U_BMU_V50_CellBalancer_U_BMU_V50_CellBalanceTaps#29.2), StringA/U_BMU_V50_CellBalancer/U_BMU_V50_CellBalanceIC (U?_StringA_U_BMU_V50_CellBalancer_U_BMU_V50_CellBalanceIC.3)
NetR?_StringA_U_BMU_V50_CellBalancer_U_BMU_V50_CellBalanceTaps#35_2: StringA/U_BMU_V50_CellBalancer/U_BMU_V50_CellBalanceTaps (R?_StringA_U_BMU_V50_CellBalancer_U_BMU_V50_CellBalanceTaps#35.2), StringA/U_BMU_V50_CellBalancer/U_BMU_V50_CellBalanceIC (U?_StringA_U_BMU_V50_CellBalancer_U_BMU_V50_CellBalanceIC.15)
NetR?_StringA_U_BMU_V50_CellBalancer_U_BMU_V50_CellBalanceTaps#40_2: StringA/U_BMU_V50_CellBalancer/U_BMU_V50_CellBalanceTaps (R?_StringA_U_BMU_V50_CellBalancer_U_BMU_V50_CellBalanceTaps#40.2), StringA/U_BMU_V50_CellBalancer/U_BMU_V50_CellBalanceIC (U?_StringA_U_BMU_V50_CellBalancer_U_BMU_V50_CellBalanceIC.5)
NetR?_StringA_U_BMU_V50_CellBalancer_U_BMU_V50_CellBalanceTaps#44_2: StringA/U_BMU_V50_CellBalancer/U_BMU_V50_CellBalanceTaps (R?_StringA_U_BMU_V50_CellBalancer_U_BMU_V50_CellBalanceTaps#44.2), StringA/U_BMU_V50_CellBalancer/U_BMU_V50_CellBalanceIC (U?_StringA_U_BMU_V50_CellBalancer_U_BMU_V50_CellBalanceIC.17)
NetR?_StringA_U_BMU_V50_CellBalancer_U_BMU_V50_CellBalanceTaps#52_2: StringA/U_BMU_V50_CellBalancer/U_BMU_V50_CellBalanceTaps (R?_StringA_U_BMU_V50_CellBalancer_U_BMU_V50_CellBalanceTaps#52.2), StringA/U_BMU_V50_CellBalancer/U_BMU_V50_CellBalanceIC (U?_StringA_U_BMU_V50_CellBalancer_U_BMU_V50_CellBalanceIC.19)
NetR?_StringA_U_BMU_V50_CellBalancer_U_BMU_V50_CellBalanceTaps#53_2: StringA/U_BMU_V50_CellBalancer/U_BMU_V50_CellBalanceTaps (R?_StringA_U_BMU_V50_CellBalancer_U_BMU_V50_CellBalanceTaps#53.2), StringA/U_BMU_V50_CellBalancer/U_BMU_V50_CellBalanceIC (U?_StringA_U_BMU_V50_CellBalancer_U_BMU_V50_CellBalanceIC.7)
NetR?_StringA_U_BMU_V50_CellBalancer_U_BMU_V50_CellBalanceTaps#60_2: StringA/U_BMU_V50_CellBalancer/U_BMU_V50_CellBalanceTaps (R?_StringA_U_BMU_V50_CellBalancer_U_BMU_V50_CellBalanceTaps#60.2), StringA/U_BMU_V50_CellBalancer/U_BMU_V50_CellBalanceIC (U?_StringA_U_BMU_V50_CellBalancer_U_BMU_V50_CellBalanceIC.9)
NetR?_StringA_U_BMU_V50_StringPWRControl#12_1: StringA/U_BMU_V50_StringPWRControl (R?_StringA_U_BMU_V50_StringPWRControl#12.1 R?_StringA_U_BMU_V50_StringPWRControl#13.2), BMU_V50_MCUcomplex (U?#1.15)
NetR?_StringB#1_3: StringB (R?_StringB#1.3 R?_StringB#2.4 R?_StringB#3.4), StringB/U_BMU_V50_StringFG (R?_StringB_U_BMU_V50_StringFG#10.1)
NetR?_StringB#1_4: StringB (R?_StringB#1.4 R?_StringB#2.3 R?_StringB#3.3), StringB/U_BMU_V50_StringFG (R?_StringB_U_BMU_V50_StringFG#11.1)
NetR?_StringB_U_BMU_V50_CellBalancer_EXT_MEAS1#1_2: StringB/U_BMU_V50_CellBalancer/U_BMU_V50_CellBalanceIC (U?_StringB_U_BMU_V50_CellBalancer_U_BMU_V50_CellBalanceIC.29), StringB/U_BMU_V50_CellBalancer/EXT_MEAS1 (R?_StringB_U_BMU_V50_CellBalancer_EXT_MEAS1#1.2), StringB/U_BMU_V50_CellBalancer/EXT_MEAS2 (R?_StringB_U_BMU_V50_CellBalancer_EXT_MEAS2#1.2), StringB/U_BMU_V50_CellBalancer/EXT_MEAS3 (R?_StringB_U_BMU_V50_CellBalancer_EXT_MEAS3#1.2), StringB/U_BMU_V50_CellBalancer/EXT_MEAS4 (R?_StringB_U_BMU_V50_CellBalancer_EXT_MEAS4#1.2)
NetR?_StringB_U_BMU_V50_CellBalancer_EXT_MEAS1#2_2: StringB/U_BMU_V50_CellBalancer/U_BMU_V50_CellBalanceIC (U?_StringB_U_BMU_V50_CellBalancer_U_BMU_V50_CellBalanceIC.24), StringB/U_BMU_V50_CellBalancer/EXT_MEAS1 (R?_StringB_U_BMU_V50_CellBalancer_EXT_MEAS1#2.2)
NetR?_StringB_U_BMU_V50_CellBalancer_EXT_MEAS2#2_2: StringB/U_BMU_V50_CellBalancer/U_BMU_V50_CellBalanceIC (U?_StringB_U_BMU_V50_CellBalancer_U_BMU_V50_CellBalanceIC.26), StringB/U_BMU_V50_CellBalancer/EXT_MEAS2 (R?_StringB_U_BMU_V50_CellBalancer_EXT_MEAS2#2.2)
NetR?_StringB_U_BMU_V50_CellBalancer_EXT_MEAS3#2_2: StringB/U_BMU_V50_CellBalancer/U_BMU_V50_CellBalanceIC (U?_StringB_U_BMU_V50_CellBalancer_U_BMU_V50_CellBalanceIC.28), StringB/U_BMU_V50_CellBalancer/EXT_MEAS3 (R?_StringB_U_BMU_V50_CellBalancer_EXT_MEAS3#2.2)
NetR?_StringB_U_BMU_V50_CellBalancer_EXT_MEAS4#2_2: StringB/U_BMU_V50_CellBalancer/U_BMU_V50_CellBalanceIC (U?_StringB_U_BMU_V50_CellBalancer_U_BMU_V50_CellBalanceIC.30), StringB/U_BMU_V50_CellBalancer/EXT_MEAS4 (R?_StringB_U_BMU_V50_CellBalancer_EXT_MEAS4#2.2)
NetR?_StringB_U_BMU_V50_CellBalancer_U_BMU_V50_CellBalanceTaps#7_2: StringB/U_BMU_V50_CellBalancer/U_BMU_V50_CellBalanceTaps (R?_StringB_U_BMU_V50_CellBalancer_U_BMU_V50_CellBalanceTaps#7.2), StringB/U_BMU_V50_CellBalancer/U_BMU_V50_CellBalanceIC (U?_StringB_U_BMU_V50_CellBalancer_U_BMU_V50_CellBalanceIC.61)
NetR?_StringB_U_BMU_V50_CellBalancer_U_BMU_V50_CellBalanceTaps#8_2: StringB/U_BMU_V50_CellBalancer/U_BMU_V50_CellBalanceTaps (R?_StringB_U_BMU_V50_CellBalancer_U_BMU_V50_CellBalanceTaps#8.2), StringB/U_BMU_V50_CellBalancer/U_BMU_V50_CellBalanceIC (U?_StringB_U_BMU_V50_CellBalancer_U_BMU_V50_CellBalanceIC.1)
NetR?_StringB_U_BMU_V50_CellBalancer_U_BMU_V50_CellBalanceTaps#11_2: StringB/U_BMU_V50_CellBalancer/U_BMU_V50_CellBalanceTaps (R?_StringB_U_BMU_V50_CellBalancer_U_BMU_V50_CellBalanceTaps#11.2), StringB/U_BMU_V50_CellBalancer/U_BMU_V50_CellBalanceIC (U?_StringB_U_BMU_V50_CellBalancer_U_BMU_V50_CellBalanceIC.11)
NetR?_StringB_U_BMU_V50_CellBalancer_U_BMU_V50_CellBalanceTaps#22_2: StringB/U_BMU_V50_CellBalancer/U_BMU_V50_CellBalanceTaps (R?_StringB_U_BMU_V50_CellBalancer_U_BMU_V50_CellBalanceTaps#22.2), StringB/U_BMU_V50_CellBalancer/U_BMU_V50_CellBalanceIC (U?_StringB_U_BMU_V50_CellBalancer_U_BMU_V50_CellBalanceIC.63)
NetR?_StringB_U_BMU_V50_CellBalancer_U_BMU_V50_CellBalanceTaps#24_2: StringB/U_BMU_V50_CellBalancer/U_BMU_V50_CellBalanceTaps (R?_StringB_U_BMU_V50_CellBalancer_U_BMU_V50_CellBalanceTaps#24.2), StringB/U_BMU_V50_CellBalancer/U_BMU_V50_CellBalanceIC (U?_StringB_U_BMU_V50_CellBalancer_U_BMU_V50_CellBalanceIC.13)
NetR?_StringB_U_BMU_V50_CellBalancer_U_BMU_V50_CellBalanceTaps#29_2: StringB/U_BMU_V50_CellBalancer/U_BMU_V50_CellBalanceTaps (R?_StringB_U_BMU_V50_CellBalancer_U_BMU_V50_CellBalanceTaps#29.2), StringB/U_BMU_V50_CellBalancer/U_BMU_V50_CellBalanceIC (U?_StringB_U_BMU_V50_CellBalancer_U_BMU_V50_CellBalanceIC.3)
NetR?_StringB_U_BMU_V50_CellBalancer_U_BMU_V50_CellBalanceTaps#35_2: StringB/U_BMU_V50_CellBalancer/U_BMU_V50_CellBalanceTaps (R?_StringB_U_BMU_V50_CellBalancer_U_BMU_V50_CellBalanceTaps#35.2), StringB/U_BMU_V50_CellBalancer/U_BMU_V50_CellBalanceIC (U?_StringB_U_BMU_V50_CellBalancer_U_BMU_V50_CellBalanceIC.15)
NetR?_StringB_U_BMU_V50_CellBalancer_U_BMU_V50_CellBalanceTaps#40_2: StringB/U_BMU_V50_CellBalancer/U_BMU_V50_CellBalanceTaps (R?_StringB_U_BMU_V50_CellBalancer_U_BMU_V50_CellBalanceTaps#40.2), StringB/U_BMU_V50_CellBalancer/U_BMU_V50_CellBalanceIC (U?_StringB_U_BMU_V50_CellBalancer_U_BMU_V50_CellBalanceIC.5)
NetR?_StringB_U_BMU_V50_CellBalancer_U_BMU_V50_CellBalanceTaps#44_2: StringB/U_BMU_V50_CellBalancer/U_BMU_V50_CellBalanceTaps (R?_StringB_U_BMU_V50_CellBalancer_U_BMU_V50_CellBalanceTaps#44.2), StringB/U_BMU_V50_CellBalancer/U_BMU_V50_CellBalanceIC (U?_StringB_U_BMU_V50_CellBalancer_U_BMU_V50_CellBalanceIC.17)
NetR?_StringB_U_BMU_V50_CellBalancer_U_BMU_V50_CellBalanceTaps#52_2: StringB/U_BMU_V50_CellBalancer/U_BMU_V50_CellBalanceTaps (R?_StringB_U_BMU_V50_CellBalancer_U_BMU_V50_CellBalanceTaps#52.2), StringB/U_BMU_V50_CellBalancer/U_BMU_V50_CellBalanceIC (U?_StringB_U_BMU_V50_CellBalancer_U_BMU_V50_CellBalanceIC.19)
NetR?_StringB_U_BMU_V50_CellBalancer_U_BMU_V50_CellBalanceTaps#53_2: StringB/U_BMU_V50_CellBalancer/U_BMU_V50_CellBalanceTaps (R?_StringB_U_BMU_V50_CellBalancer_U_BMU_V50_CellBalanceTaps#53.2), StringB/U_BMU_V50_CellBalancer/U_BMU_V50_CellBalanceIC (U?_StringB_U_BMU_V50_CellBalancer_U_BMU_V50_CellBalanceIC.7)
NetR?_StringB_U_BMU_V50_CellBalancer_U_BMU_V50_CellBalanceTaps#60_2: StringB/U_BMU_V50_CellBalancer/U_BMU_V50_CellBalanceTaps (R?_StringB_U_BMU_V50_CellBalancer_U_BMU_V50_CellBalanceTaps#60.2), StringB/U_BMU_V50_CellBalancer/U_BMU_V50_CellBalanceIC (U?_StringB_U_BMU_V50_CellBalancer_U_BMU_V50_CellBalanceIC.9)
NetR?_StringB_U_BMU_V50_StringPWRControl#12_1: BMU_V50_MCUcomplex (U?#1.16), StringB/U_BMU_V50_StringPWRControl (R?_StringB_U_BMU_V50_StringPWRControl#12.1 R?_StringB_U_BMU_V50_StringPWRControl#13.2)
NetU?#1_8: StringA/U_BMU_V50_StringPWRControl (U?_StringA_U_BMU_V50_StringPWRControl.6), BMU_V50_MCUcomplex (U?#1.8)
NetU?#1_9: BMU_V50_MCUcomplex (U?#1.9), StringB/U_BMU_V50_StringPWRControl (U?_StringB_U_BMU_V50_StringPWRControl.6)
NetU?#1_10: BMU_V50_MCUcomplex (U?#1.10), StringB/U_BMU_V50_StringPWRControl (U?_StringB_U_BMU_V50_StringPWRControl.4)
NetU?#1_17: StringA/U_BMU_V50_StringPWRControl (U?_StringA_U_BMU_V50_StringPWRControl.7), BMU_V50_MCUcomplex (U?#1.17)
NetU?#1_24: StringA/U_BMU_V50_StringPWRControl (U?_StringA_U_BMU_V50_StringPWRControl.4), BMU_V50_MCUcomplex (U?#1.24)
NetU?#1_25: StringA/U_BMU_V50_CellBalancer/U_BMU_V50_CellBalanceIC (U?_StringA_U_BMU_V50_CellBalancer_U_BMU_V50_CellBalanceIC.46), BMU_V50_MCUcomplex (U?#1.25)
NetU?#1_26: BMU_V50_MCUcomplex (U?#1.26), StringB/U_BMU_V50_StringPWRControl (U?_StringB_U_BMU_V50_StringPWRControl.5)
NetU?#1_29: BMU_V50_MCUcomplex (U?#1.29), StringB/U_BMU_V50_StringPWRControl (U?_StringB_U_BMU_V50_StringPWRControl.8)
NetU?#1_33: StringA/U_BMU_V50_StringPWRControl (U?_StringA_U_BMU_V50_StringPWRControl.5), BMU_V50_MCUcomplex (U?#1.33)
NetU?#1_37: BMU_V50_MCUcomplex (U?#1.37), StringB/U_BMU_V50_CellBalancer/U_BMU_V50_CellBalanceIC (U?_StringB_U_BMU_V50_CellBalancer_U_BMU_V50_CellBalanceIC.46)
NetU?#1_41: BMU_V50_MCUcomplex (U?#1.41), StringB/U_BMU_V50_StringPWRControl (U?_StringB_U_BMU_V50_StringPWRControl.7)
NetU?#1_50: StringA/U_BMU_V50_StringPWRControl (U?_StringA_U_BMU_V50_StringPWRControl.8), BMU_V50_MCUcomplex (U?#1.50)
NetU?#1_55: StringA/U_BMU_V50_CellBalancer/U_BMU_V50_CellBalanceIC (U?_StringA_U_BMU_V50_CellBalancer_U_BMU_V50_CellBalanceIC.47), BMU_V50_MCUcomplex (U?#1.55), StringB/U_BMU_V50_CellBalancer/U_BMU_V50_CellBalanceIC (U?_StringB_U_BMU_V50_CellBalancer_U_BMU_V50_CellBalanceIC.47)
~{SPI_CS_BAL1}: StringA/U_BMU_V50_CellBalancer/U_BMU_V50_CellBalanceIC (U?_StringA_U_BMU_V50_CellBalancer_U_BMU_V50_CellBalanceIC.52), BMU_V50_MCUcomplex (U?#1.20)
~{SPI_CS_BAL2}: BMU_V50_MCUcomplex (U?#1.30), StringB/U_BMU_V50_CellBalancer/U_BMU_V50_CellBalanceIC (U?_StringB_U_BMU_V50_CellBalancer_U_BMU_V50_CellBalanceIC.52)
SPI_MISO: StringA/U_BMU_V50_CellBalancer/U_BMU_V50_CellBalanceIC (U?_StringA_U_BMU_V50_CellBalancer_U_BMU_V50_CellBalanceIC.49), BMU_V50_MCUcomplex (U?#1.35), StringB/U_BMU_V50_CellBalancer/U_BMU_V50_CellBalanceIC (U?_StringB_U_BMU_V50_CellBalancer_U_BMU_V50_CellBalanceIC.49)
SPI_MOSI: StringA/U_BMU_V50_CellBalancer/U_BMU_V50_CellBalanceIC (U?_StringA_U_BMU_V50_CellBalancer_U_BMU_V50_CellBalanceIC.50), BMU_V50_MCUcomplex (U?#1.36), StringB/U_BMU_V50_CellBalancer/U_BMU_V50_CellBalanceIC (U?_StringB_U_BMU_V50_CellBalancer_U_BMU_V50_CellBalanceIC.50)
SPI_SCK: StringA/U_BMU_V50_CellBalancer/U_BMU_V50_CellBalanceIC (U?_StringA_U_BMU_V50_CellBalancer_U_BMU_V50_CellBalanceIC.53), BMU_V50_MCUcomplex (U?#1.34), StringB/U_BMU_V50_CellBalancer/U_BMU_V50_CellBalanceIC (U?_StringB_U_BMU_V50_CellBalancer_U_BMU_V50_CellBalanceIC.53)